# Altium project nodeMCU vs motor.PrjPCB
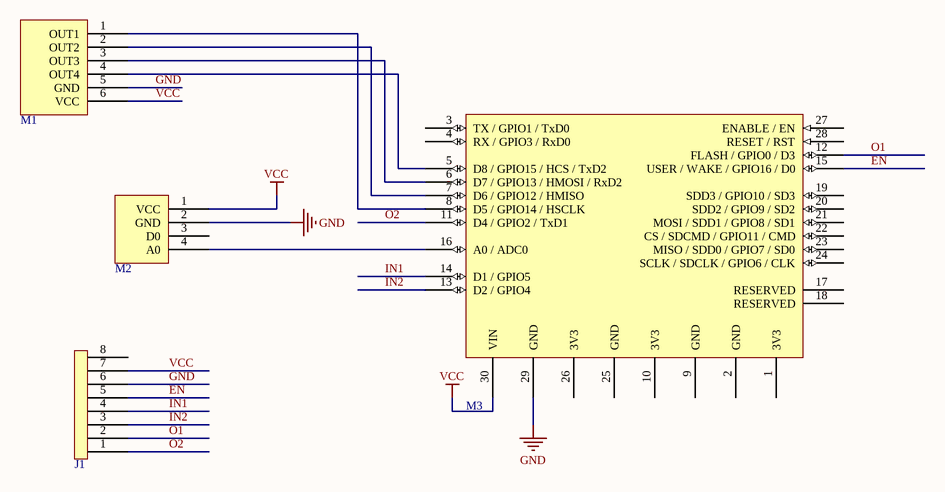
[diagram p0: nodeMCU vs motor.SchDoc]
1 sheet, 4 parts. Net scope: global (net labels, ports and power ports of the same name join across sheets).
Board file: nodeMCU vs motor.PcbDoc

## Sheet nodeMCU vs motor.SchDoc
size A4

### Parts
J1  JP_8  [JP_8]  (value not drawn)
M1  Module TTP224  [MODULE_TTP224]  (value not drawn)
M2  Module LDR  [MODULE LDR]  (value not drawn)
M3  NodeMCU  [NODEMCU_V1.0_LABEL_OUTSIDE]  (value not drawn)

### Nets
GND: J1.6 M1.5(GND) M2.2(GND) M3.29(GND)
VCC: J1.7 M1.6(VCC) M2.1(VCC) M3.30(VIN)
EN: J1.5 M3.15(USER_/_WAKE_/_GPIO16_/_D0)
IN1: J1.4 M3.14(D1_/_GPIO5)
IN2: J1.3 M3.13(D2_/_GPIO4)
O1: J1.2 M3.12(FLASH_/_GPIO0_/_D3)
O2: J1.1 M3.11(D4_/_GPIO2_/_TxD1)
NetM1_1: M1.1(OUT1) M3.8(D5_/_GPIO14_/_HSCLK)
NetM1_2: M1.2(OUT2) M3.7(D6_/_GPIO12_/_HMISO)
NetM1_3: M1.3(OUT3) M3.6(D7_/_GPIO13_/_HMOSI_/_RxD2)
NetM1_4: M1.4(OUT4) M3.5(D8_/_GPIO15_/_HCS_/_TxD2)
NetM2_4: M2.4(A0) M3.16(A0_/_ADC0)

Not connected (* = marked no-connect by the designer): J1 8; M2 3(D0); M3 1(3V3) 2(GND) 3(TX_/_GPIO1_/_TxD0) 4(RX_/_GPIO3_/_RxD0) 9(GND) 10(3V3) 17(RESERVED) 18(RESERVED) 19(SDD3_/_GPIO10_/_SD3) 20(SDD2_/_GPIO9_/_SD2) 21(MOSI_/_SDD1_/_GPIO8_/_SD1) 22(CS_/_SDCMD_/_GPIO11_/_CMD) 23(MISO_/_SDD0_/_GPIO7_/_SD0) 24(SCLK_/_SDCLK_/_GPIO6_/_CLK) 25(GND) 26(3V3) 27(ENABLE_/_EN) 28(RESET_/_RST)

### Library data of the parts
M3 = NodeMCU-v1.0: NodeMCU DevKit v1.0